# Altium schematic sheet No.3 跳线板.SchDoc
size A4
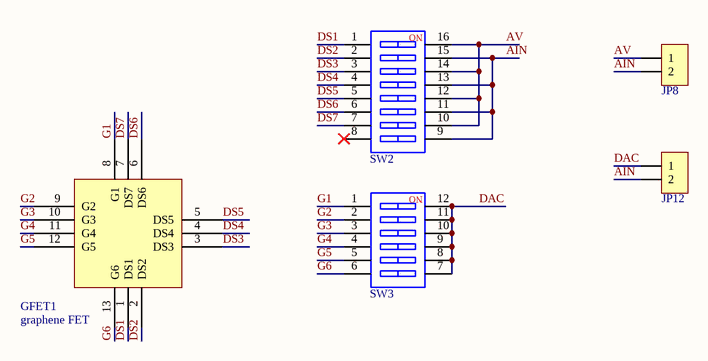
[diagram p0: No.3 跳线板.SchDoc]

## Parts
GFET1  graphene FET  [graphene FET]
JP8  HDR-1X2  [XH2.54-WI-2P]  (value not drawn)
JP12  HDR-1X2  [XH2.54-WI-2P]  (value not drawn)
SW2  CSW-8P  [CSW1.27 SMD-8P]  (value not drawn)
SW3  CSW-6P  [CSW1.27 SMD-6P]  (value not drawn)

## Nets
AIN: JP8.2 JP12.2 SW2.9 SW2.11 SW2.13 SW2.15
AV: JP8.1 SW2.10 SW2.12 SW2.14 SW2.16
DAC: JP12.1 SW3.7 SW3.8 SW3.9 SW3.10 SW3.11 SW3.12
DS1: GFET1.1(DS1) SW2.1
DS2: GFET1.2(DS2) SW2.2
DS3: GFET1.3(DS3) SW2.3
DS4: GFET1.4(DS4) SW2.4
DS5: GFET1.5(DS5) SW2.5
DS6: GFET1.6(DS6) SW2.6
DS7: GFET1.7(DS7) SW2.7
G1: GFET1.8(G1) SW3.1
G2: GFET1.9(G2) SW3.2
G3: GFET1.10(G3) SW3.3
G4: GFET1.11(G4) SW3.4
G5: GFET1.12(G5) SW3.5
G6: GFET1.13(G6) SW3.6

Not connected (* = marked no-connect by the designer): SW2 8*

## Notes on the sheet
- (in symbol CSW-6P) NO
- (in symbol CSW-8P) NO

## Library data of the parts
JP8 JP12 = Header 2: 2P接插件; 版权归属: 源创客; BOM名称: 2P接插件; 学习资源: www.ooocke.com
SW2 = CSW-8P: 8路编码开关; 版权归属: 源创客; BOM名称: 8路编码开关; 学习资源: www.ooocke.com
SW3 = CSW-6P: 6路编码开关; 版权归属: 源创客; BOM名称: 6路编码开关; 学习资源: www.ooocke.com